# Altium schematic sheet ADC088S022.SchDoc
size A4; SheetNumber: 7; SheetTotal: 15
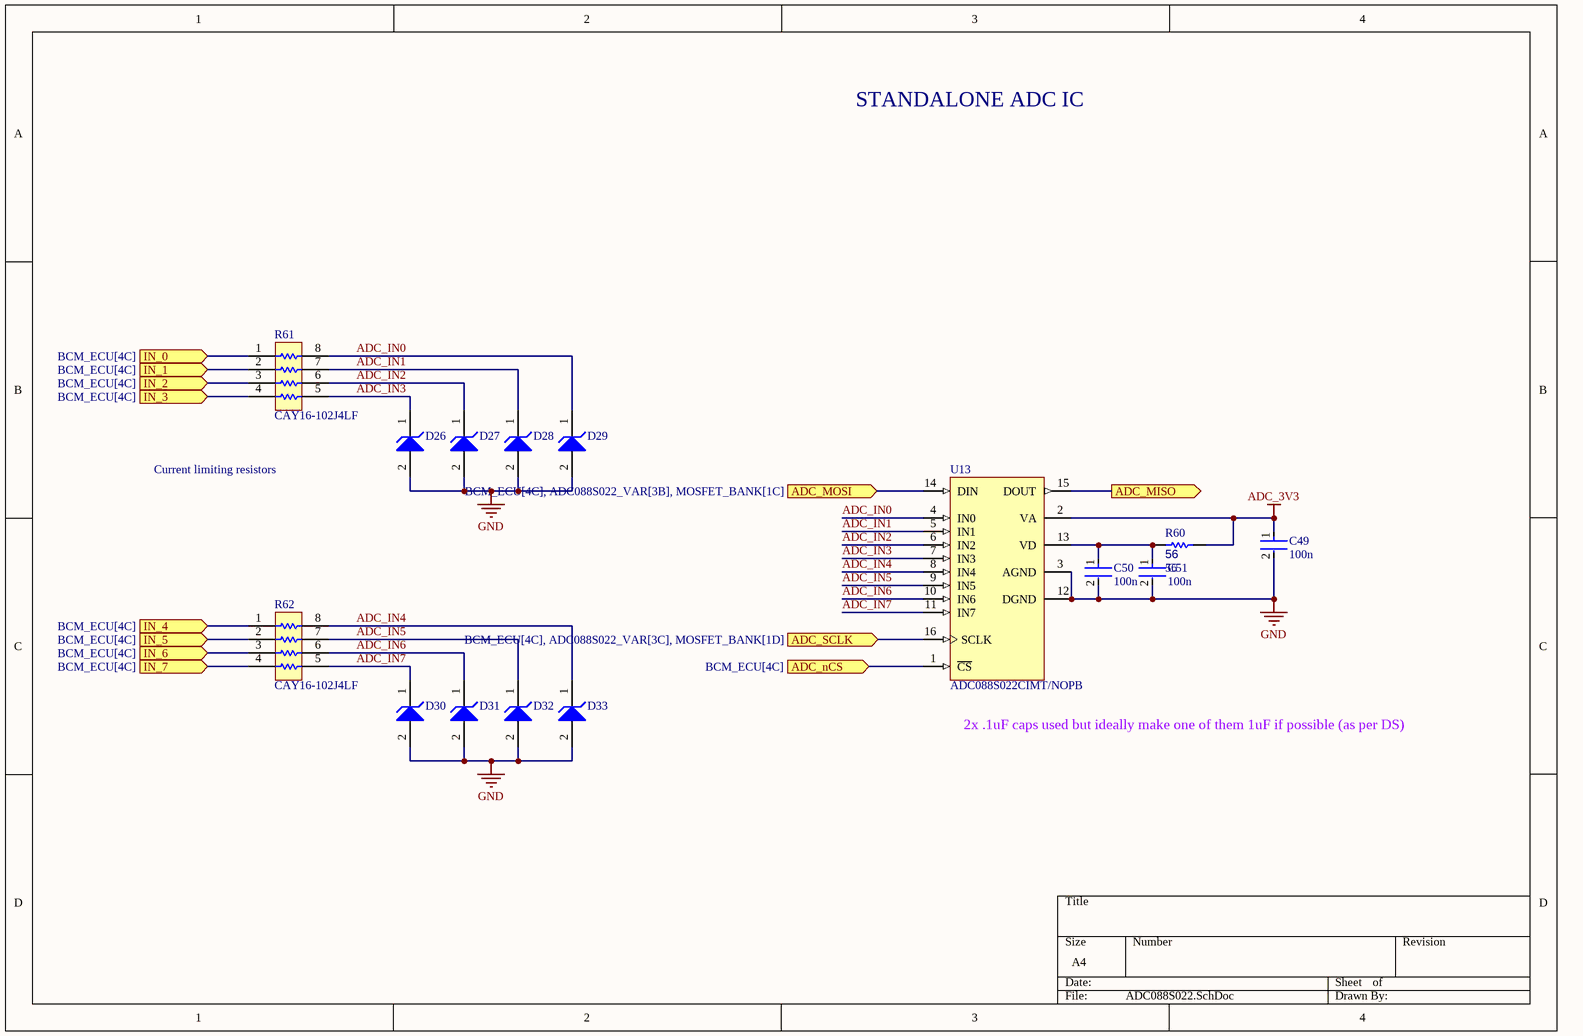
[diagram p0: ADC088S022.SchDoc]

## Parts
C49  100n  [FP-0402-L_1_0_0_05-W_0_5-IPC_A]
C50  100n  [FP-0402-L_1_0_0_05-W_0_5-IPC_A]
C51  100n  [FP-0402-L_1_0_0_05-W_0_5-IPC_A]
D26  MM5Z3V3T1G  [ONSC-SOD-523-2-502-01_V]  (value not drawn)
D27  MM5Z3V3T1G  [ONSC-SOD-523-2-502-01_V]  (value not drawn)
D28  MM5Z3V3T1G  [ONSC-SOD-523-2-502-01_V]  (value not drawn)
D29  MM5Z3V3T1G  [ONSC-SOD-523-2-502-01_V]  (value not drawn)
D30  MM5Z3V3T1G  [ONSC-SOD-523-2-502-01_V]  (value not drawn)
D31  MM5Z3V3T1G  [ONSC-SOD-523-2-502-01_V]  (value not drawn)
D32  MM5Z3V3T1G  [ONSC-SOD-523-2-502-01_V]  (value not drawn)
D33  MM5Z3V3T1G  [ONSC-SOD-523-2-502-01_V]  (value not drawn)
R60  56  [R0603B]
R61  CAY16-102J4LF  [BOUR-CAY16-J4_V]
R62  CAY16-102J4LF  [BOUR-CAY16-J4_V]
U13  ADC088S022CIMT/NOPB  [MTC16_L]

## Ports
ADC_MISO (out, see BCM_ECU[4C], ADC088S022_VAR[3B], MOSFET_BANK[1C]), ADC_MOSI (in, see BCM_ECU[4C], ADC088S022_VAR[3B], MOSFET_BANK[1C]), ADC_nCS (in, see BCM_ECU[4C]), ADC_SCLK (in, see BCM_ECU[4C], ADC088S022_VAR[3C], MOSFET_BANK[1D]), IN_0 (in, see BCM_ECU[4C]), IN_1 (in, see BCM_ECU[4C]), IN_2 (in, see BCM_ECU[4C]), IN_3 (in, see BCM_ECU[4C]), IN_4 (in, see BCM_ECU[4C]), IN_5 (in, see BCM_ECU[4C]), IN_6 (in, see BCM_ECU[4C]), IN_7 (in, see BCM_ECU[4C])

## Nets
ADC_3V3: C49.1 R60.1 U13.2(VA)
GND: C49.2 C50.2 C51.2 D26.2(A) D27.2(A) D28.2(A) D29.2(A) D30.2(A) D31.2(A) D32.2(A) D33.2(A) U13.3(AGND) U13.12(DGND)
ADC_IN0: D29.1(K) R61.8 U13.4(IN0)
ADC_IN1: D28.1(K) R61.7 U13.5(IN1)
ADC_IN2: D27.1(K) R61.6 U13.6(IN2)
ADC_IN3: D26.1(K) R61.5 U13.7(IN3)
ADC_IN4: D33.1(K) R62.8 U13.8(IN4)
ADC_IN5: D32.1(K) R62.7 U13.9(IN5)
ADC_IN6: D31.1(K) R62.6 U13.10(IN6)
ADC_IN7: D30.1(K) R62.5 U13.11(IN7)
ADC_MISO: U13.15(DOUT) ; port ADC_MISO
ADC_MOSI: U13.14(DIN) ; port ADC_MOSI
ADC_nCS: U13.1(~{CS}) ; port ADC_nCS
ADC_SCLK: U13.16(SCLK) ; port ADC_SCLK
IN_0: R61.1 ; port IN_0
IN_1: R61.2 ; port IN_1
IN_2: R61.3 ; port IN_2
IN_3: R61.4 ; port IN_3
IN_4: R62.1 ; port IN_4
IN_5: R62.2 ; port IN_5
IN_6: R62.3 ; port IN_6
IN_7: R62.4 ; port IN_7
NetC50_1: C50.1 C51.1 R60.2 U13.13(VD)

## Notes on the sheet
- STANDALONE ADC IC
- Current limiting resistors
- (near U13) 2x .1uF caps used but ideally make one of them 1uF if possible (as per DS)

## Library data of the parts
C49-C51 = CMP-001-00058-1: LARGE PADS, 0402 CAP, CHANGE COMMENT TO MATCH REAL P/N; Capacitor Type: Ceramic; Min Operating Temperature: -55°C; Mounting Technology: Surface Mount; Pins: 2; Case/Package: 0402; RoHS Compliant: Yes; Max Operating Temperature: 85°C
D26-D33 = CMP-1060-00750-1: Zener Voltage Regulator, 500 mW, 2-Pin SOD-523, Pb-Free, Tape and Reel; Manufacturer: On Semiconductor; P Max (W): 0.5; VZ Typ (V): 3.3; RoHS: Pb-Free; ComponentLink2Description: Datasheet; PackageReference: SOD-523-2-502-01; DatasheetVersion: Rev. 10; ComponentLink1Description: Manufacturer URL; PackageVersion: Rev. E, 09/2010; ComponentLink3URL: http://www.onsemi.com/pub_link/Collateral/502-01.PDF; ComponentLink2URL: http://www.onsemi.cn/pub_link/Collateral/MM5Z2V4T1-D.PDF; Mounting Technology: Surface Mount; PartNumber: MM5Z3V3T1G; Packing: Tape and Reel; PackageDescription: 2-Pin SOD, Body 1.2 x 0.8 mm; ComponentLink1URL: http://www.onsemi.com/; ComponentLink3Description: Package Specification
R60 = CMP-009-00002-14: Resistor; Value: 56
R61 R62 = CMP-1747-00007-1: Chip Resistor Array, 1 KOhm, +/- 5%, 62.5 mW, -55 to 125 degC, 8-Pin SMD, RoHS, Tape and Reel; Power Rating: 100 mW; Tolerance: 1%; Voltage Rating (DC): 50 V; Resistance: 330 Ohm; Case\Package: 0603; RoHSCompliant: true; Case Code (Metric): 1608; Pins: 2; PackageDescription: 8-Pin Surface Mount Device, Body 1.6 x 3.2 mm, Pitch 0.8 mm; Height: 0.45 mm; Min Operating Temperature: -55 degC; ComponentLink1URL: http://www.bourns.com/; Case Code (Imperial): 0603; Packaging: Tape and Reel; PackageReference: CAY16-J4; ComponentLink1Description: Manufacturer URL; ComponentLink2Description: Datasheet; Length: 1.6 mm; Width: 0.8 mm; Max Operating Temperature: 155 degC; Mount: Surface Mount; DatasheetVersion: Sep-14; Voltage Rating: 50 V; REACH SVHC: No SVHC; ComponentLink2URL: http://www.bourns.com/pdfs/CATCAY.pdf; Package Quantity: 5000
U13 = CMP-0054-00372-2: 8-Channel, 50 kSPS to 200 kSPS, 8-Bit A/D Converter, 16-pin TSSOP, Pb-Free; Manufacturer: National Semiconductor; PackageTopMarking: NSUZXYTT*88S022*CIMT; CompType: ADC IC; PowerWise: Y; ComponentLink2URL: http://www.national.com/pf/AD/ADC088S022.html; RoHS: Y; PackageDescription: Molded TSSOP, Jedec, 5 x 4.4 x 0.9mm Body, 16 Lead, 0.65mm Pitch; DatasheetVersion: Feb-2010; PinCount: 16; ComponentLink1Description: ADC088S022 Datasheet; Code_JEDEC: MO-153-AB; ComponentLink3URL: http://www.national.com/packaging/folders/mtc16.html; PackageVersion: revD, Jun-2003; ComponentLink3Description: MTC16 Package Page; RevisionNote: Component URLs added; ComponentLink1URL: http://www.national.com/ds/AD/ADC088S022.pdf; ComponentLink2Description: ADC088S022 Web Page; PackageReference: MTC16